# Altium project Prototype.PrjPcb
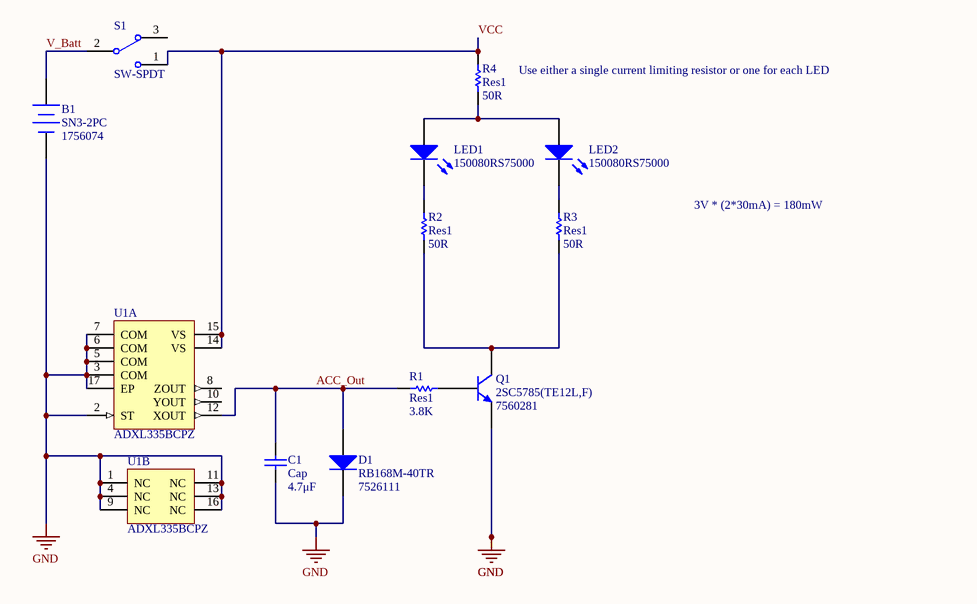
[diagram p0: Sheet1.SchDoc]
1 sheet, 12 parts. Net scope: global (net labels, ports and power ports of the same name join across sheets).
Board file: PCB1.PcbDoc

## Sheet Sheet1.SchDoc
size A4

### Parts
B1  SN3-2PC  Supplier Part Number 1: 1756074  [Battery Holder]
C1  Cap  value 4.7μF  [Capacitor 0603]
D1  RB168M-40TR  Supplier Part Number 1: 7526111  [SODFL350X90-2N]
LED1  150080RS75000  [0805_A]
LED2  150080RS75000  [0805_A]
Q1  2SC5785(TE12L,F)  Supplier Part Number 1: 7560281  [SOT89-150P410X160-3N]
R1  Res1  value 3.8K  [Resistor 1206]
R2  Res1  value 50R  [Resistor 1206]
R3  Res1  value 50R  [Resistor 1206]
R4  Res1  value 50R  [Resistor 1206]
S1  SW-SPDT  [JS202011SCQN Switch]
U1  ADXL335BCPZ  [ADI-CP-16-14_L]  (parts A,B of 2)

### Nets
GND: B1.2(-) C1.1 D1.2(K) Q1.3(E) U1.1(NC) U1.2(ST) U1.3(COM) U1.4(NC) U1.5(COM) U1.6(COM) U1.7(COM) U1.9(NC) U1.11(NC) U1.13(NC) U1.16(NC) U1.17(EP)
ACC_Out: C1.2 D1.1(A) R1.1 U1.12(XOUT)
V_Batt: B1.1(+) S1.2
VCC: R4.2 S1.1 U1.14(VS) U1.15(VS)
NetLED1_1: LED1.1(K) R2.2
NetLED1_2: LED1.2(A) LED2.2(A) R4.1
NetLED2_1: LED2.1(K) R3.2
NetQ1_1: Q1.1(B) R1.2
NetQ1_2: Q1.2(C) R2.1 R3.1

Not connected (* = marked no-connect by the designer): S1 3; U1 8(ZOUT) 10(YOUT)

### Notes on the sheet
- (near R4) Use either a single current limiting resistor or one for each LED
- 3V * (2*30mA) = 180mW

### Library data of the parts
B1 = SN3-2PC: Battery Holder with Lead Wire / Pin / Snap Terminal; Manufacturer: Takachi; Supplier 1: RSComponents; Manufacturer Part Number: SN3-2PC; RoHS: No; Stock 1: 65
C1 = Cap: Capacitor; Published: 8-Jun-2000; LatestRevisionDate: 17-Jul-2002; LatestRevisionNote: Re-released for DXP Platform.; PackageReference: RAD-0.3; Publisher: Altium Limited; PackageDescription: Radial Cap, Thru-Hole; 2 Leads; 0.3 in Pin Spacing
D1 = RB168M-40TR: DIODE SCHOTTKY 40V 1A PMDU; Manufacturer: Rohm; Max Reverse Current: 50nA; Element Configuration: Single; Forward Voltage: 600mV; Max Forward Surge Current (Ifsm): 30A; Supplier 1: RSComponents; Manufacturer Part Number: RB168M-40TR; RoHS: Yes; Category: Rectifier Diodes; Stock 1: 1110; Mount: Surface Mount; Case/Package: SOD-123-2; Number of Pins: 2; Weight: 0.000363oz; Min Operating Temperature: -55°C; Max Operating Temperature: 150°C; Packaging: Tape and Reel; Forward Current: 1A; Package Quantity: 3000; Termination: SMD/SMT; Reverse Voltage (DC): 40V; Average Rectified Current: 1A; Max Repetitive Reverse Voltage (Vrrm): 40V; Peak Non-Repetitive Surge Current: 30A; Max Reverse Voltage (DC): 40V; Length: 2.6mm; Width: 1.6mm; Height: 0.8mm; Radiation Hardening: No; Lead Free: Lead Free; ComponentLink1URL: https://datasheet.ciiva.com/29592/rb168m-40-29592360.pdf?src-supplier=Digi-Key; ComponentLink1Description: https://datasheet.ciiva.com/29592/rb168m-40-29592360.pdf?src-supplier=Digi-Key; ComponentLink2URL: https://datasheet.ciiva.com/14920/diodekousei-14920856.pdf?src-supplier=Digi-Key; ComponentLink2Description: https://datasheet.ciiva.com/14920/diodekousei-14920856.pdf?src-supplier=Digi-Key; ComponentLink3URL: https://datasheet.ciiva.com/29592/diodekousei-29592361.pdf?src-supplier=Digi-Key; ComponentLink3Description: https://datasheet.ciiva.com/29592/diodekousei-29592361.pdf?src-supplier=Digi-Key
LED1 LED2 = CMP-1426-00011-1: SMD mono-color Chip LED, WL-SMCW, Red; Manufacturer: Wuerth Elektronik; Color: Red; PartNumber: 150080RS75000; PackageReference: 0805_A; ComponentLink2Description: Datasheet; ComponentLink1URL: http://www.we-online.com; ComponentLink1Description: Manufacturer URL; ComponentLink2URL: http://katalog.we-online.com/led/datasheet/150080RS75000.pdf
Q1 = 2SC5785(TE12L,F): NPN Bipolar Transistor, 2 A, 10 V, 3-Pin SC-62; Manufacturer: Toshiba; Supplier 1: RSComponents; Manufacturer Part Number: 2SC5785(TE12L,F); RoHS: No; Category: Uncategorized; Stock 1: 40
R1-R4 = Res1: Resistor; Published: 8-Jun-2000; LatestRevisionDate: 17-Jul-2002; LatestRevisionNote: Re-released for DXP Platform.; PackageReference: AXIAL-0.3; Publisher: Altium Limited; PackageDescription: Axial Device, Thru-Hole; 2 Leads; 0.3 in Pin Spacing
S1 = SW-SPDT: SPDT Subminiature Toggle Switch, Right Angle Mounting, Vertical Actuation; Published: 24-Mar-1999; LatestRevisionDate: 17-Dec-2003; LatestRevisionNote: Schematic revised, PCB Footprint replaced.; DatasheetVersion: 05-Dec-2000; PackageReference: TL36WW15050; Publisher: Altium Limited; PackageDescription: Switch; 4 Leads; ComponentLink1Description: Manufacturer Link; ComponentLink1URL: http://www.apem.com
U1 = CMP-0885-00046-1: Small, Low Power, 3-Axis +/-3 g Accelerometer with Analog Output, 1.6 KHz BW, Industrial, 16-pin QFN, Tray; Manufacturer: Analog Devices; Sensitivity: 300 mV/g; Voltage Supply (V): 1.8 to 3.6; Supply Current: 350 uA; # of Axes: 3; -3dB Bandwidth: 1.6 KHz; ComponentLink4URL: http://www.analog.com/en/mems-sensors/mems-inertial-sensors/adxl335/products/product.html; PackageVersion: 051909-A, 05/2009; PackageReference: CP-16-14; PackageDescription: 16-Pin Lead Frame Chip Scale Package, 4 x 4 mm Body, 0.65 mm Pitch; ComponentLink1Description: Manufacturer URL; Code_JEDEC: MO-220-WGGD; PartNumber: ADXL335BCPZ; ComponentLink4Description: Product URL; ComponentLink1URL: http://www.analog.com/en/index.html; ComponentLink3URL: http:/www.analog.com/static/imported-files/packages/PKG_PDF/LFCSP(CP)/CP-16/CP_16_14.pdf; Mounting Technology: Surface Mount; ComponentLink3Description: Package Specification; Packing: Tray; Output Type: Analog; ComponentLink2URL: http://www.analog.com/static/imported-files/data_sheets/ADXL335.pdf; ComponentLink2Description: Datasheet; DatasheetVersion: Rev. B